# Altium project COMECA-Adaptator.PrjPcb
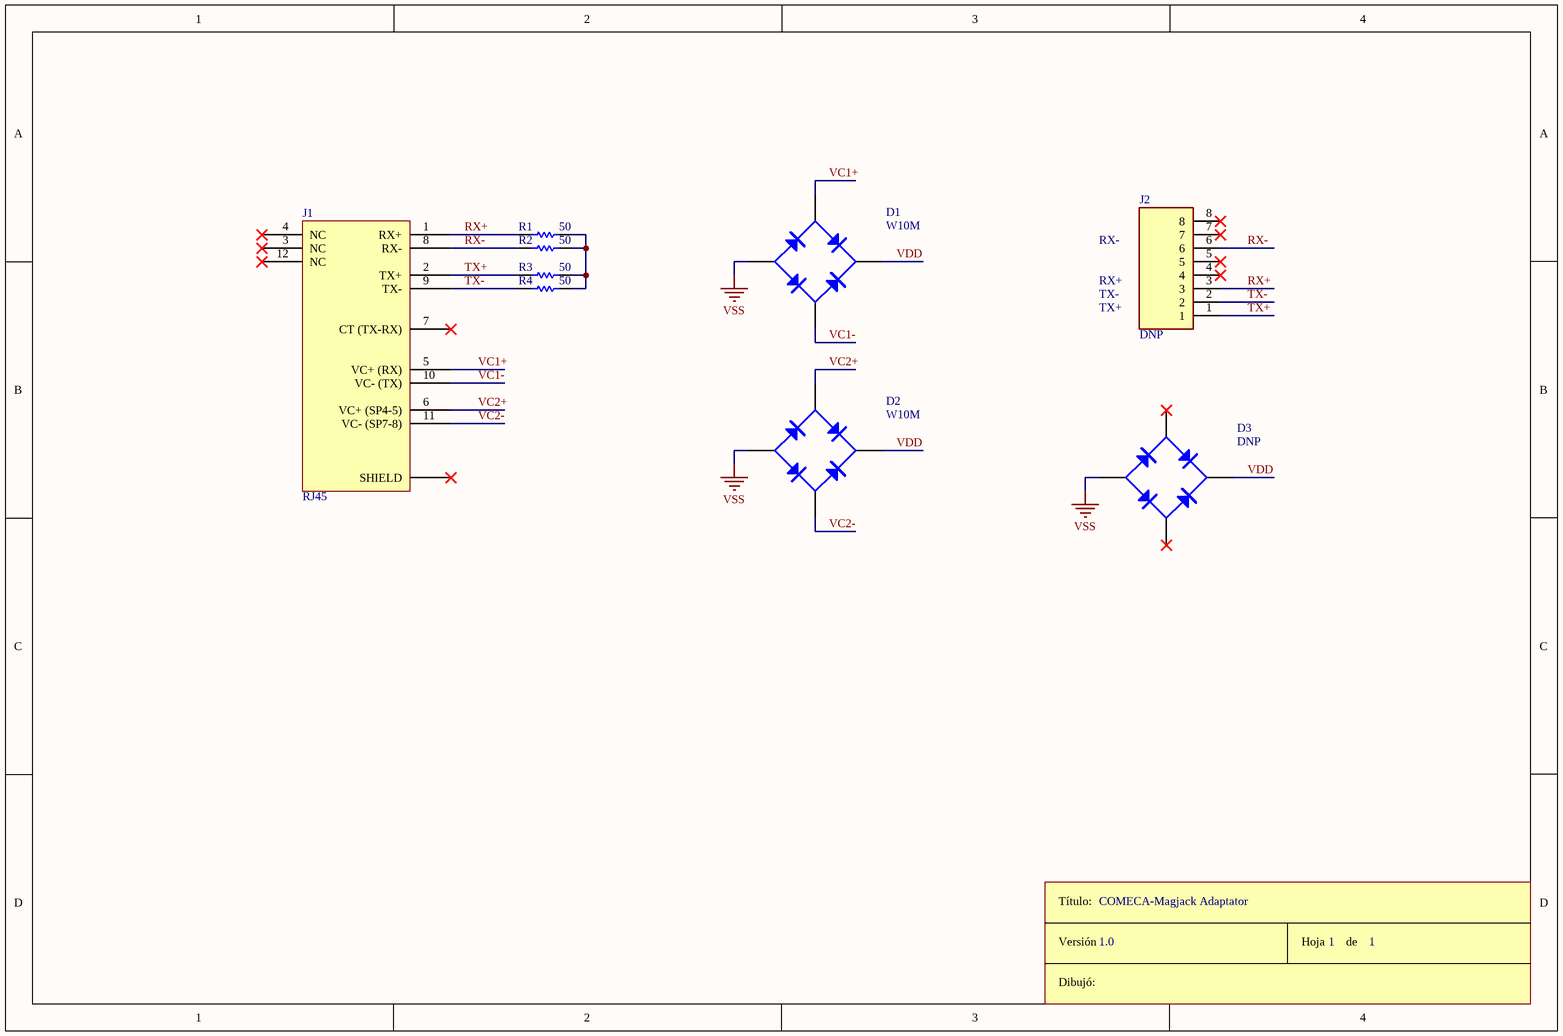
[diagram p0: Adaptator.SchDoc]
1 sheet, 10 parts. Net scope: global (net labels, ports and power ports of the same name join across sheets).
Board file: Adaptator-PCB.PcbDoc

## Sheet Adaptator.SchDoc
size A4; SheetNumber: 1; SheetTotal: 1

### Parts
D1  W10M  [PUENTE - W10M]
D2  W10M  [PUENTE - W10M]
D3  DNP  [PUENTE - W10M]
J1  RJ45  [ARJP11C-MB]
J2  DNP  [CUI_CRJ032-1-TH]
R1  50  [RES400]
R2  50  [RES400]
R3  50  [RES400]
R4  50  [RES400]
ROT1  Rotulo  (value not drawn)  (graphical)

### Nets
VSS: D1.3(V-) D2.3(V-) D3.3(V-)
RX+: J1.1(RX+) J2.3 R1.1
RX-: J1.8(RX-) J2.6 R2.1
TX+: J1.2(TX+) J2.1 R3.1
TX-: J1.9(TX-) J2.2 R4.1
VC1+: D1.2(AC) J1.5(VC+_(RX))
VC1-: D1.4(AC) J1.10(VC-_(TX))
VC2+: D2.2(AC) J1.6(VC+_(SP4-5))
VC2-: D2.4(AC) J1.11(VC-_(SP7-8))
VDD: D1.1(V+) D2.1(V+) D3.1(V+)
NetR1_2: R1.2 R2.2 R3.2 R4.2

Not connected (* = marked no-connect by the designer): D3 2(AC)* 4(AC)*; J1 3(NC)* 4(NC)* 7(CT_(TX-RX))* 12(NC)* SHIELD*; J2 4* 5* 7* 8*

### Notes on the sheet
- RX-
- TX+
- TX-
- RX+
- COMECA-Magjack Adaptator
- 1.0
- 1
- (in symbol Rótulo) Título:; Versión; Hoja       de; Dibujó:

### Library data of the parts
D1-D3 = PUENTE
J1 = ARJP11C-MBSC-L2: Magjack Connector for PoE
J2 = CRJ032-1-TH: 8P8C, Single Port, Horizontal, Unshielded, No LED, Through Hole, RJ45 Modular Connector; MF: CUI Devices; MP: CRJ032-1-TH; SnapEDA_Link: https://www.snapeda.com/parts/CRJ032-1-TH/CUI%20Devices/view-part/6363031/?ref=snap; Availability: In Stock; CUI_purchase_URL: https://www.cuidevices.com/product/interconnect/connectors/modular-connectors/rj45-connectors/crj032-1-th?utm_source=snapeda.com&utm_medium=referral&utm_campaign=snapedaBOM; Check_prices: https://www.snapeda.com/parts/CRJ032-1-TH/CUI%20Devices/view-part/6363031/?ref=eda; Value: *; Purchase-URL: https://pricing.snapeda.com/search/part/CRJ032-1-TH/?ref=eda; Package: None; Price: None
R1-R4 = RES
ROT1 = Rótulo